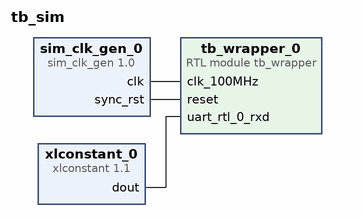
[diagram p0: block diagram of the top level]
# Vivado block design tb_sim, xcku025-ffva1156-1-c, Vivado 2022.2
create_bd_design tb_sim

create_bd_cell -type ip -vlnv xilinx.com:ip:sim_clk_gen:1.0 sim_clk_gen_0
set_property -dict {CONFIG.INITIAL_RESET_CLOCK_CYCLES 8 CONFIG.RESET_POLARITY ACTIVE_HIGH} [get_bd_cells sim_clk_gen_0]
create_bd_cell -type ip -vlnv xilinx.com:ip:xlconstant:1.1 xlconstant_0
create_bd_cell -type module -reference tb_wrapper tb_wrapper_0

# ---- connections ----

connect_bd_net [get_bd_pins sim_clk_gen_0/clk] [get_bd_pins tb_wrapper_0/clk_100MHz]
connect_bd_net [get_bd_pins sim_clk_gen_0/sync_rst] [get_bd_pins tb_wrapper_0/reset]
connect_bd_net [get_bd_pins xlconstant_0/dout] [get_bd_pins tb_wrapper_0/uart_rtl_0_rxd]

validate_bd_design
save_bd_design
